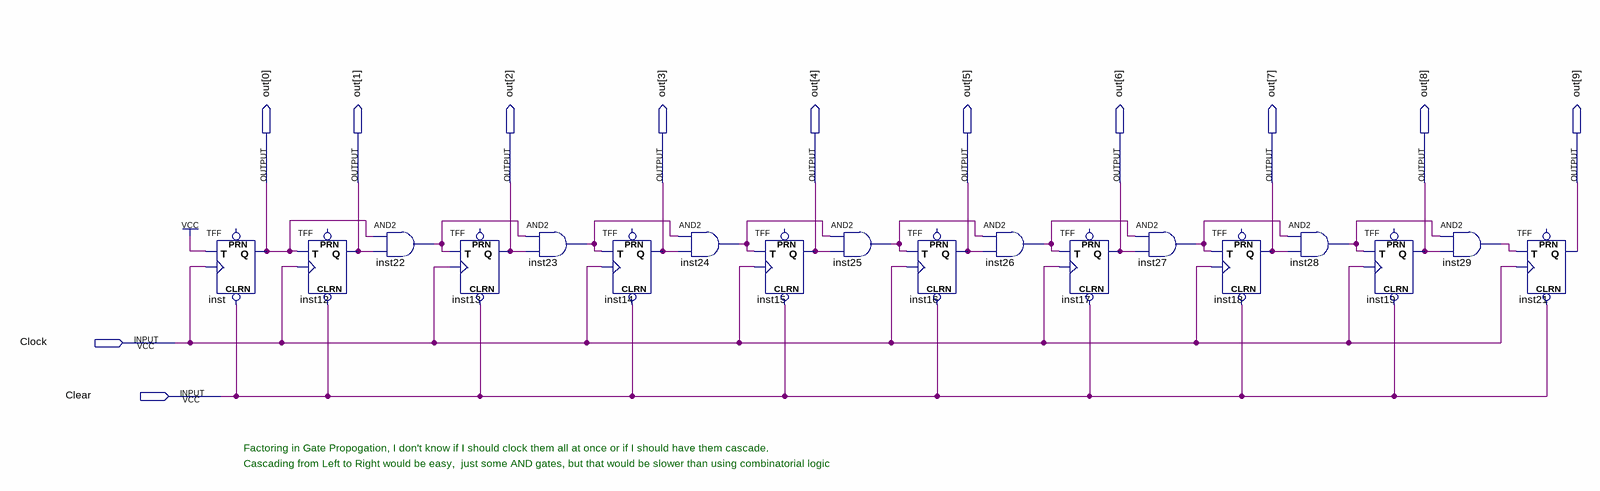
[diagram p0: schematic sheet]
// Quartus schematic counter10bit.bdf as structural Verilog: 18 symbols, 12 pins
module counter10bit (
  input  Clock,
  input  Clear,
  output [9:0] out
);

  wire inst22_out, inst23_out, inst24_out, inst25_out, inst26_out, inst27_out, inst28_out, inst29_out;

  TFF inst (.CLRN(Clear), .T(1'b1), .CLK(Clock), .Q(out[0]));  // open: PRN
  TFF inst12 (.CLRN(Clear), .T(out[0]), .CLK(Clock), .Q(out[1]));  // open: PRN
  and inst22 (inst22_out, out[0], out[1]);
  TFF inst13 (.CLRN(Clear), .T(inst22_out), .CLK(Clock), .Q(out[2]));  // open: PRN
  and inst23 (inst23_out, inst22_out, out[2]);
  TFF inst14 (.CLRN(Clear), .T(inst23_out), .CLK(Clock), .Q(out[3]));  // open: PRN
  and inst24 (inst24_out, inst23_out, out[3]);
  TFF inst15 (.CLRN(Clear), .T(inst24_out), .CLK(Clock), .Q(out[4]));  // open: PRN
  and inst25 (inst25_out, inst24_out, out[4]);
  TFF inst16 (.CLRN(Clear), .T(inst25_out), .CLK(Clock), .Q(out[5]));  // open: PRN
  and inst26 (inst26_out, inst25_out, out[5]);
  TFF inst17 (.CLRN(Clear), .T(inst26_out), .CLK(Clock), .Q(out[6]));  // open: PRN
  and inst27 (inst27_out, inst26_out, out[6]);
  TFF inst18 (.CLRN(Clear), .T(inst27_out), .CLK(Clock), .Q(out[7]));  // open: PRN
  and inst28 (inst28_out, inst27_out, out[7]);
  TFF inst19 (.CLRN(Clear), .T(inst28_out), .CLK(Clock), .Q(out[8]));  // open: PRN
  and inst29 (inst29_out, inst28_out, out[8]);
  TFF inst21 (.CLRN(Clear), .T(inst29_out), .CLK(Clock), .Q(out[9]));  // open: PRN

  // Notes on the sheet:
  //   Factoring in Gate Propogation, I don't know if I should clock them all at once or if I should have them cascade.
  //   Cascading from Left to Right would be easy,  just some AND gates, but that would be slower than using combinatorial logic
endmodule
